# EAGLE design 411_Preliminary Design_ Group8_rev4 (EAGLE 9.6.2)
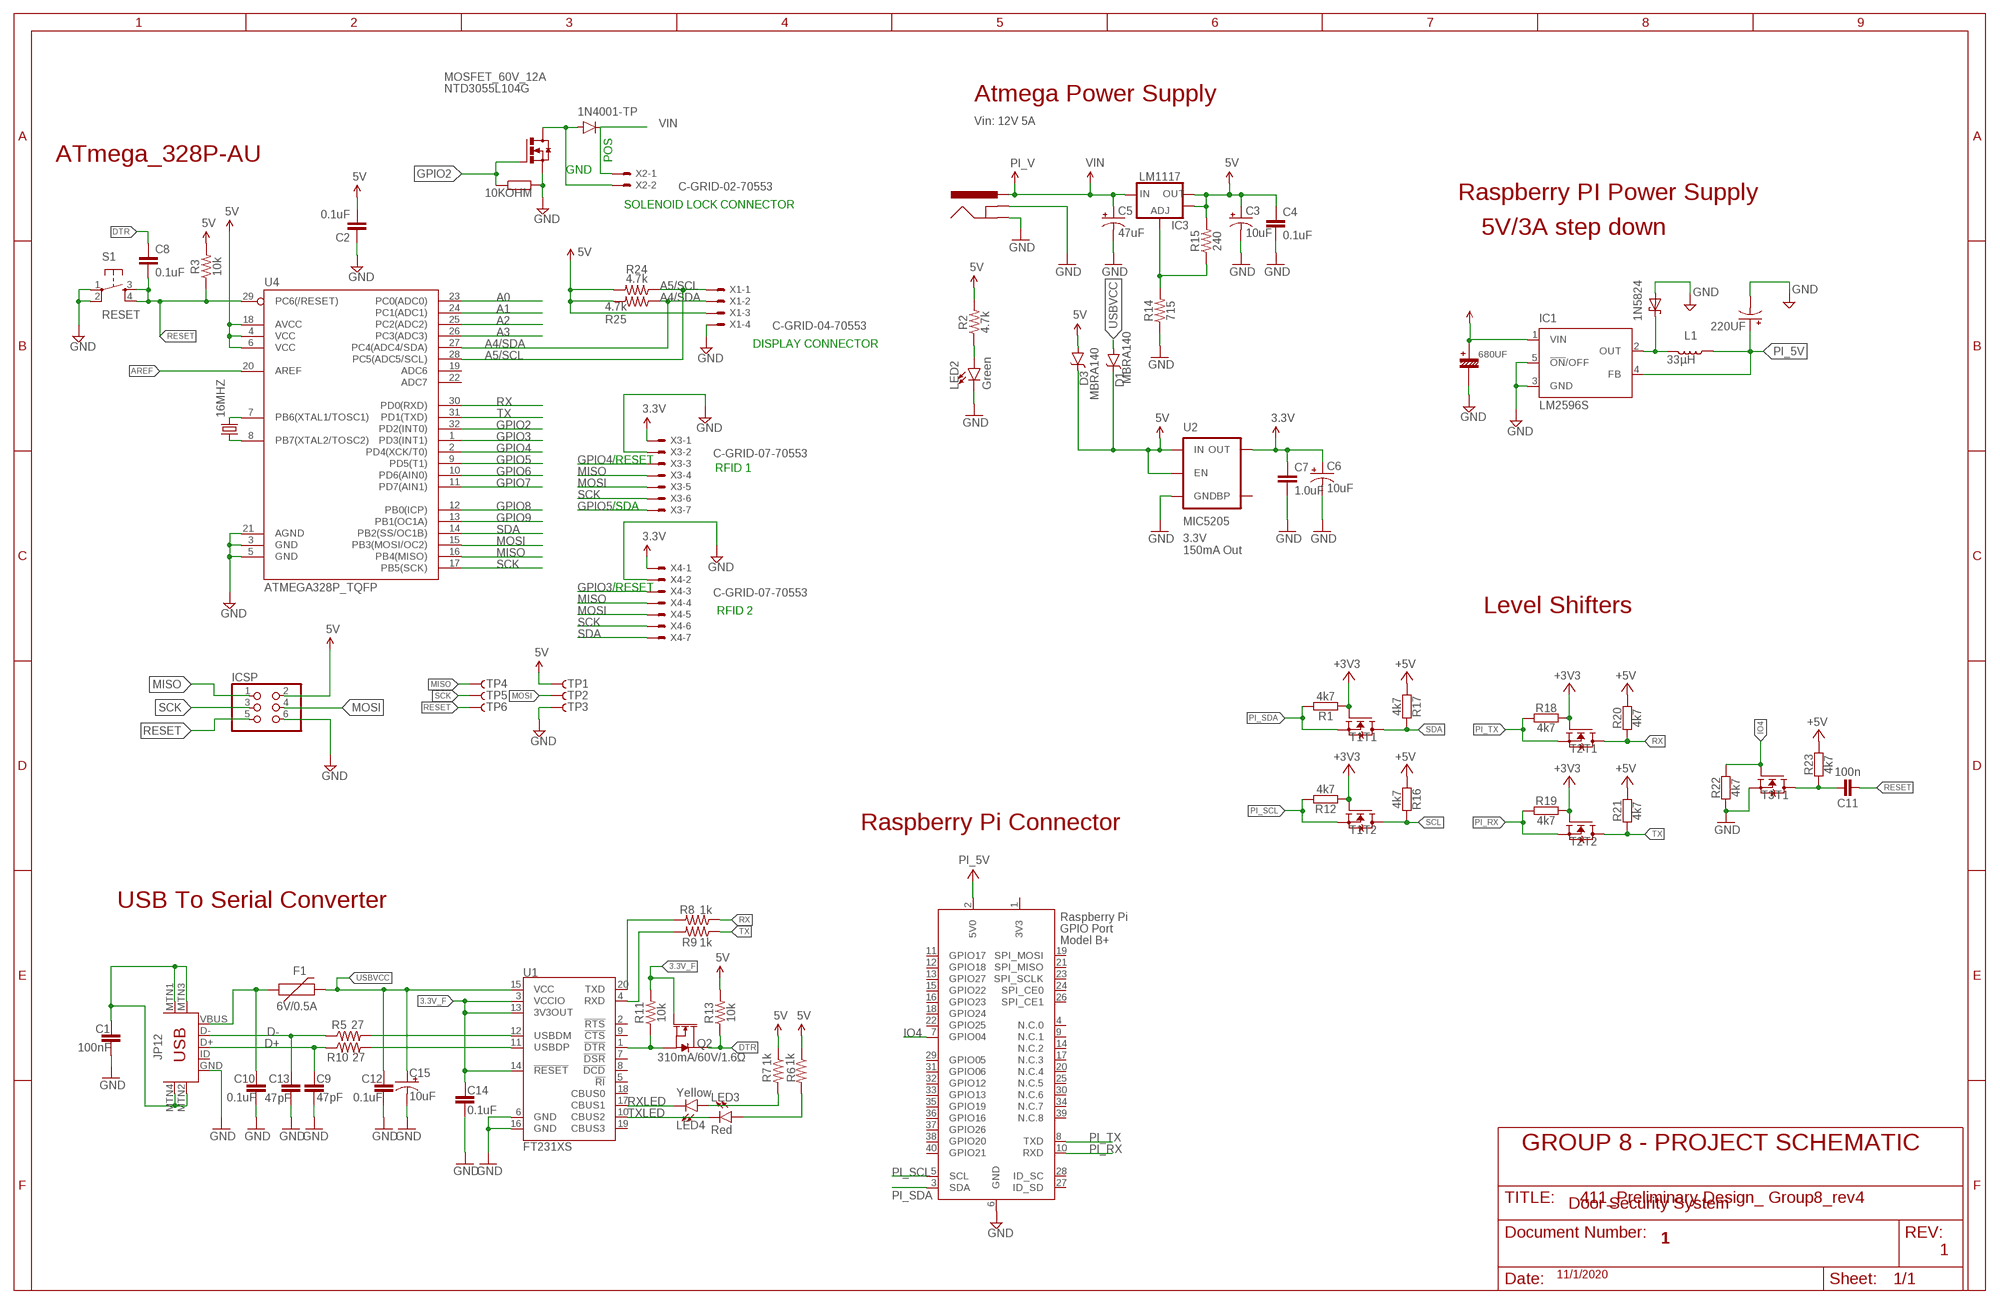
[diagram p0: schematic, sheet 1]

## Parts
1N5824  SCHOTTKY-DIODECB429-15  [CB429-15]
10KOHM  R  (no package)
16MHZ  CRYSTALHC49S  [HC49/S]
220UF  CPOL-US139CLL-2R  [139CLL-2R]
680UF  CE-16V-10-5.08  [16V-10-5.08]
C1  100nF  0.1UF-0603-25V-(+80/-20%)  [0603]
C2  0.1uF  0.1UF-0603-25V-(+80/-20%)  [0603]
C3  10uF  10UF-POLAR-EIA3216-16V-10%(TANT)  [EIA3216]
C4  0.1uF  0.1UF-0603-25V-(+80/-20%)  [0603]
C5  47uF  47UF-POLAR-PANASONIC_D-35V-20%  [PANASONIC_D]
C6  10uF  10UF-POLAR-EIA3216-16V-10%(TANT)  [EIA3216]
C7  1.0uF  1.0UF-0603-16V-10%  [0603]
C8  0.1uF  0.1UF-0603-25V-(+80/-20%)  [0603]
C9  47pF  47PF-0603-50V-5%  [0603]
C10  0.1uF  0.1UF-0603-25V-(+80/-20%)  [0603]
C11  100n  CAPACITOR-0402  [C0402]
C12  0.1uF  0.1UF-0603-25V-(+80/-20%)  [0603]
C13  47pF  47PF-0603-50V-5%  [0603]
C14  0.1uF  0.1UF-0603-25V-(+80/-20%)  [0603]
C15  10uF  10UF-POLAR-EIA3216-16V-10%(TANT)  [EIA3216]
D1  MBRA140  [SMA-DIODE]
D3  MBRA140  [SMA-DIODE]
F1  6V/0.5A  PTC-HALF_AMP  [1206]
IC1  LM2596S  [TO263-5]
IC3  LM1117  V_REG_LM1117ALT1  [SOT223-ALT1]
ICSP  PINHD-2X3  [2X03]
J3  POWER_JACKSUPER_BOMB_DIGITY  [POWER_JACK_SMD_OVERPASTE_SUPER_BOMB_DIGITY]
JP12  USB-MINIB-5PIN  [USB-MINIB]
L1  33µH  INDUCTOR-0805-3.3UH  [0805]
LED2  Green  LED1206  [LED-1206]
LED3  Red  LED1206  [LED-1206]
LED4  Yellow  LED1206  [LED-1206]
MOSFET_60V_12A  NTD3055L104G  [DPAK3]
Q2  310mA/60V/1.6Ω  MOSFET-NCH-2N7002PW  [SOT323]
R1  4k7  RESISTOR-0402  [C0402]
R2  4.7k  4.7KOHM-0603-1/10W-1%  [0603]
R3  10k  10KOHM-0603-1/10W-1%  [0603]
R5  27  27OHM-0603-1/10W-1%  [0603]
R6  1k  1KOHM-0603-1/10W-1%  [0603]
R7  1k  1KOHM-0603-1/10W-1%  [0603]
R8  1k  1KOHM-0603-1/10W-1%  [0603]
R9  1k  1KOHM-0603-1/10W-1%  [0603]
R10  27  27OHM-0603-1/10W-1%  [0603]
R11  10k  10KOHM-0603-1/10W-1%  [0603]
R12  4k7  RESISTOR-0402  [C0402]
R13  10k  10KOHM-0603-1/10W-1%  [0603]
R14  715  715OHM-0603-1/10W-1%  [0603]
R15  240  240OHM-0603-1/10W-1%  [0603]
R16  4k7  RESISTOR-0402  [C0402]
R17  4k7  RESISTOR-0402  [C0402]
R18  4k7  RESISTOR-0402  [C0402]
R19  4k7  RESISTOR-0402  [C0402]
R20  4k7  RESISTOR-0402  [C0402]
R21  4k7  RESISTOR-0402  [C0402]
R22  4k7  RESISTOR-0402  [C0402]
R23  4k7  RESISTOR-0402  [C0402]
R24  4.7k  4.7KOHM-0603-1/10W-1%  [0603]
R25  4.7k  4.7KOHM-0603-1/10W-1%  [0603]
S1  RESET  SWITCH_SPST_4_PINSQUARE  [TACTILE-SWITCH-SMD]
T1  BSS138PS  [SOT363]
T2  BSS138PS  [SOT363]
T3  BSS138PS  [SOT363]
TP1  TP-3x5  TEST-POINT3X5  [PAD.03X.05]
TP2  TP-3x5  TEST-POINT3X5  [PAD.03X.05]
TP3  TP-3x5  TEST-POINT3X5  [PAD.03X.05]
TP4  TP-3x5  TEST-POINT3X5  [PAD.03X.05]
TP5  TP-3x5  TEST-POINT3X5  [PAD.03X.05]
TP6  TP-3x5  TEST-POINT3X5  [PAD.03X.05]
U1  FT231XS  [SSOP20_L]
U2  MIC5205  MIC52053.3V  [SOT23-5]
U4  ATMEGA328P_TQFP  [TQFP32-08]
X1  C-GRID-04-70553  [70553-04]
X2  C-GRID-02-70553  [70553-02]
X3  C-GRID-07-70553  [70553-07]
X4  C-GRID-07-70553  [70553-07]
X5  RASPI_BOARD_B+_E4P  [RASPI_BOARD_B+_EDGES_4DRILL_PAD]

## Nets
3.3V: C6.+ C7.1 U2.5(OUT) X3.1 X4.1
3.3V_F: C14.1 Q2.1(G) R11.2 U1.3(VCCIO) U1.13(3V3OUT) U1.14(!RESET)
5V: 680UF.+ C2.2 C3.+ C4.1 D1.C D3.A D3.C IC1.1(VIN) IC3.2(OUT) IC3.4(OUT) ICSP.2 R2.2 R3.2 R6.1 R7.1 R13.2 R15.2 R24.2 R25.2 TP1.P$1 U2.1(IN) U2.3(EN) U4.4(VCC) U4.6(VCC) U4.18(AVCC) X1.3 ; supply symbol labelled PI_V
+3V3: R1.1 R12.1 R18.2 R19.2 T1.2(T1:G) T1.5(T2:G) T2.2(T1:G) T2.5(T2:G)
+5V: R16.1 R17.1 R20.2 R21.2 R23.2
A0: U4.23(PC0(ADC0))
A1: U4.24(PC1(ADC1))
A2: U4.25(PC2(ADC2))
A3: U4.26(PC3(ADC3))
A4/SDA: R25.1 U4.27(PC4(ADC4/SDA)) X1.2
A5/SCL: R24.1 U4.28(PC5(ADC5/SCL)) X1.1
AREF: U4.20(AREF)
D0_RX1: C11.2 R23.1 T3.6(T1:D)
D+: C9.1 JP12.D+ R10.1
D-: C13.1 JP12.D- R5.1
DTR: C8.1 Q2.3(D) R13.1
FTDI_DTR: Q2.2(S) R11.1 U1.1(!DTR)
GND: 1N5824.A 10KOHM.2 220UF.- 680UF.- C1.2 C2.1 C3.- C4.2 C5.- C6.- C7.2 C9.2 C10.2 C12.2 C13.2 C14.2 C15.- IC1.3(GND) IC1.5(!ON!/OFF) ICSP.6 J3.GND(GNDBREAK) J3.P$4(GND) JP12.GND LED2.C MOSFET_60V_12A.2(S) R14.1 R22.1 S1.1 S1.2 T3.1(T1:S) TP3.P$1 U1.6(GND) U1.16(GND) U2.2(GND) U4.3(GND) U4.5(GND) U4.21(AGND) X1.4 X3.2 X4.2 X5.6(GND)
GPIO2: 10KOHM.1 MOSFET_60V_12A.1(G) U4.32(PD2(INT0))
GPIO3: U4.1(PD3(INT1)) X4.3
GPIO4: U4.2(PD4(XCK/T0)) X3.3
GPIO5: U4.9(PD5(T1)) X3.7
GPIO6: U4.10(PD6(AIN0))
GPIO7: U4.11(PD7(AIN1))
GPIO8: U4.12(PB0(ICP))
GPIO9: U4.13(PB1(OC1A))
IO4: R22.2 T3.2(T1:G) X5.7(GPIO04)
MISO: ICSP.1 TP4.P$1 U4.16(PB4(MISO)) X3.4 X4.4
MOSI: ICSP.4 TP2.P$1 U4.15(PB3(MOSI/OC2)) X3.5 X4.5
N$1: 1N5824.C IC1.2(OUT) L1.2
N$2: LED2.A R2.1
N$3: 16MHZ.2 U4.7(PB6(XTAL1/TOSC1))
N$4: 16MHZ.1 U4.8(PB7(XTAL2/TOSC2))
N$5: MOSFET_60V_12A.3(D) X2.2
N$6: R5.2 U1.12(USBDM)
N$7: R10.2 U1.11(USBDP)
N$8: LED3.A R6.2
N$10: LED4.A R7.2
N$15: IC3.1(ADJ) R14.2 R15.1
N$17: C1.1 JP12.MTN1(MTN2) JP12.MTN2(MTN3) JP12.MTN3(MTN1) JP12.MTN4
PI_5V: 220UF.+ IC1.4(FB) L1.1 X5.2(5V0) ; supply symbol labelled +5V
PI_RX: R19.1 T2.4(T2:S) X5.10(RXD)
PI_SCL: R12.2 T1.4(T2:S) X5.5(SCL)
PI_SDA: R1.2 T1.1(T1:S) X5.3(SDA)
PI_TX: R18.1 T2.1(T1:S) X5.8(TXD)
RESET: C8.2 C11.1 ICSP.5 R3.1 S1.3 S1.4 TP6.P$1 U4.29(PC6(/RESET))
RX: R8.1 R20.1 T2.6(T1:D) U4.30(PD0(RXD))
RXD: R9.2 U1.4(RXD)
RXLED: LED4.C U1.17(CBUS1)
SCK: ICSP.3 TP5.P$1 U4.17(PB5(SCK)) X3.6 X4.6
SCL: R16.2 T1.3(T2:D)
SDA: R17.2 T1.6(T1:D) U4.14(PB2(SS/OC1B)) X4.7
TX: R9.1 R21.1 T2.3(T2:D) U4.31(PD1(TXD))
TXD: R8.2 U1.20(TXD)
TXLED: LED3.C U1.10(CBUS2)
USBVCC: C12.1 C15.+ D1.A F1.2 U1.15(VCC)
VIN: C5.+ IC3.3(IN) J3.VIN0(PWR) X2.1 ; supply symbol labelled PI_V
VUSB: C10.1 F1.1 JP12.VBUS
Unconnected: JP12.ID T3.3(T2:D) T3.4(T2:S) T3.5(T2:G) U1.2(!RTS) U1.5(!RI) U1.7(!DSR) U1.8(!DCD) U1.9(!CTS) U1.18(CBUS0) U1.19(CBUS3) U2.4(BP) U4.19(ADC6) U4.22(ADC7) X5.4(N.C.0) X5.9(N.C.1) X5.11(GPIO17) X5.12(GPIO18) X5.13(GPIO27) X5.14(N.C.2) X5.15(GPIO22) X5.16(GPIO23) X5.17(N.C.3) X5.18(GPIO24) X5.19(SPI_MOSI) X5.20(N.C.4) X5.21(SPI_MISO) X5.22(GPIO25) X5.23(SPI_SCLK) X5.24(SPI_CE0) X5.25(N.C.5) X5.26(SPI_CE1) X5.27(ID_SD) X5.28(ID_SC) X5.29(GPIO05) X5.30(N.C.6) X5.31(GPIO06) X5.32(GPIO12) X5.33(GPIO13) X5.34(N.C.7) X5.35(GPIO19) X5.36(GPIO16) X5.37(GPIO26) X5.38(GPIO20) X5.39(N.C.8) X5.40(GPIO21)

## Notes on the sheet
- Atmega Power Supply
- 1N4001-TP
- Vin: 12V 5A
- ATmega_328P-AU | POS
- GND
- Raspberry PI Power Supply
- SOLENOID LOCK CONNECTOR
- 5V/3A step down
- DISPLAY CONNECTOR
- /RESET | RFID 1
- /SDA
- 3.3V
  150mA Out
- /RESET
- RFID 2 | Level Shifters
- SDA
- Level Shifter
- Raspberry Pi Connector
- USB To Serial Converter
- GROUP 8 - PROJECT SCHEMATIC
- Door Security System
- 1
- 1
- 11/1/2020

## Power pins joined to a net without a drawn wire
3V3: X5.1(3V3)

## Library data of the parts
1N5824 = adafruit:SCHOTTKY-DIODE: Schottky Diode
10KOHM = ngspice-simulation:R: RESISTOR
16MHZ = crystal:CRYSTAL: CRYSTAL; OC_FARNELL: 1667008; OC_NEWARK: unknown
220UF = adafruit:CPOL-US: POLARIZED CAPACITOR, American symbol
680UF = c-j:CE-: ELECTROLYTIC CAPACITOR Japanese symbol
C1 = SparkFun-Capacitors:0.1UF: 0.1µF ceramic capacitors A capacitor is a passive two-terminal electrical component used to store electrical energy temporarily in an electric field.; PROD_ID: CAP-00810; VALUE: 0.1uF
C2 C4 C8 C10 C12 C14 = SparkFun-Capacitors:0.1UF: 0.1µF ceramic capacitors A capacitor is a passive two-terminal electrical component used to store electrical energy temporarily in an electric field.; PROD_ID: CAP-00810
C3 C6 C15 = SparkFun-Capacitors:10UF-POLAR: 10.0µF polarized capacitors A capacitor is a passive two-terminal electrical component used to store electrical energy temporarily in an electric field.; PROD_ID: CAP-00811
C5 = SparkFun-Capacitors:47UF-POLAR: 47µF polarized capacitors A capacitor is a passive two-terminal electrical component used to store electrical energy temporarily in an electric field.; PROD_ID: CAP-08478
C7 = SparkFun-Capacitors:1.0UF: 1µF ceramic capacitors A capacitor is a passive two-terminal electrical component used to store electrical energy temporarily in an electric field.; PROD_ID: CAP-00868
C9 C13 = SparkFun-Capacitors:47PF: 47pF ceramic capacitors A capacitor is a passive two-terminal electrical component used to store electrical energy temporarily in an electric field.; PROD_ID: CAP-08913
C11 = we-rcl:CAPACITOR: Capacitors ...4.7uF @ 6.3V -> 0402 ...10uF @ 16V -> 0603 ...22uF @ 25V -> 0805
D1 D3 = SparkFun-DiscreteSemi:MBRA140: 40V, 1A Schottky rectifier SMA/DO-214AC package DIO-08053; PROD_ID: DIO-08053
F1 = SparkFun-Fuses:PTC: Resettable Fuse PTC Resettable Fuse. Really a resistor with a postive temperature coefficient who's resistance increases dramatically with an increase in temperature. When heated by the power passing through the resistance rises causing the current to be limited, protecting the circuit. When a PTC cools back down it resumes conducting letting the circuit turn back on.; PROD_ID: RES-08585
IC1 = national-semiconductor:LM2596: SIMPLE SWITCHER® Power Converter 150 kHz 3A Step-Down Voltage Regulator Source: http://www.national.com/ds/LM/LM2596.pdf; MF: NATIONAL SEMICONDUCTOR; MPN: LM2596S-ADJ/NOPB; OC_FARNELL: 9494367; OC_NEWARK: 41K3842
IC3 = Testing:V_REG_LM1117: Voltage Regulator LM1117 Standard adjustable voltage regulator but in SMD form. Spark Fun Electronics SKU : COM-00595; PROD_ID: VREG-08170
ICSP = pinhead:PINHD-2X3: PIN HEADER
J3 = Testing:POWER_JACK: Power Jack This is the standard 5.5mm barrel jack for power. The PTH is the most common, proven, reliable, footprint. All others are experimental. The Slot footprint only works if the mill layer is transmitted to the PCB fab house so be warned. Spark Fun Electronics SKU : PRT-00119. Mating wall wart : TOL-00298 (and others); PROD_ID: CONN-08106
JP12 = SparkFun-Connectors:USB-MINIB: Mini-USB "B" connector with 5th pin broken out. Created new symbol breaking out 5th "ID" pin in mini/micro USB connector spec. See: http://en.wikipedia.org/wiki/Mini_usb#Cables. Uses same footprint as 4-pin symbol. Also added pins to connect to mounting / shield pads if required (probably not generally needed as signals aren't shielded once they leave the connector).; PROD_ID: CONN-08193
L1 = SparkFun-Coils:INDUCTOR: Inductors Resist changes in electrical current. Basically a coil of wire. SparkFun Products: SparkFun Load Cell Amplifier - HX711 <https://www.sparkfun.com/products/13879> IOIO-OTG - V2.2 <https://www.sparkfun.com/products/13613>; PROD_ID: NDUC-13076; VALUE: 3.3µH/±20%/450mA
LED2 = SparkFun-LED:LED: LED (Generic) Standard schematic elements and footprints for 5mm, 3mm, 1206, and 0603 sized LEDs. Generic LEDs with no color specified.; PROD_ID: DIO-09910
LED3 = SparkFun-LED:LED: LED (Generic) Standard schematic elements and footprints for 5mm, 3mm, 1206, and 0603 sized LEDs. Generic LEDs with no color specified.; PROD_ID: DIO-09912
LED4 = SparkFun-LED:LED: LED (Generic) Standard schematic elements and footprints for 5mm, 3mm, 1206, and 0603 sized LEDs. Generic LEDs with no color specified.; PROD_ID: DIO-09909
MOSFET_60V_12A = Transistor:NTD3055L104G: 12 A, 60 V, Logic Level N−Channel DPAK/IPAK Manufacturer's datasheet <https://www.onsemi.com/pub/Collateral/NTD3055L104-D.PDF>; CREATED_BY: PCBLayout.com; MANUFACTURER: ON SEMICONDUCTORS; MPN: NTD3055L104G; PACKAGE: DPAK-4
Q2 = SparkFun-DiscreteSemi:MOSFET-NCH: N-channel MOSFETs Voltage controlled devices that allow control of high current outputs. SparkFun Products: SparkFun OpenScale <https://www.sparkfun.com/products/13261> SparkFun Digital Sandbox <https://www.sparkfun.com/products/12651> SparkFun Monster Moto Shield <https://www.sparkfun.com/products/10182> SparkFun MOSFET Power Controller <https://www.sparkfun.com/products/11214>; PROD_ID: TRANS-11151
R1 R12 R16-R23 = we-rcl:RESISTOR: Resistors all kinds in 0603 and 0402
R2 R24 R25 = SparkFun-Resistors:4.7KOHM: 4.7kΩ resistor A resistor is a passive two-terminal electrical component that implements electrical resistance as a circuit element. Resistors act to reduce current flow, and, at the same time, act to lower voltage levels within circuits. - Wikipedia; PROD_ID: RES-07857
R3 R11 R13 = SparkFun-Resistors:10KOHM: 10kΩ resistor A resistor is a passive two-terminal electrical component that implements electrical resistance as a circuit element. Resistors act to reduce current flow, and, at the same time, act to lower voltage levels within circuits. - Wikipedia; PROD_ID: RES-00824
R5 R10 = SparkFun-Resistors:27OHM: 27Ω resistor A resistor is a passive two-terminal electrical component that implements electrical resistance as a circuit element. Resistors act to reduce current flow, and, at the same time, act to lower voltage levels within circuits. - Wikipedia; PROD_ID: RES-09334
R6-R9 = SparkFun-Resistors:1KOHM: 1kΩ resistor A resistor is a passive two-terminal electrical component that implements electrical resistance as a circuit element. Resistors act to reduce current flow, and, at the same time, act to lower voltage levels within circuits. - Wikipedia; PROD_ID: RES-07856
R14 = SparkFun-Resistors:715OHM: 715Ω resistor A resistor is a passive two-terminal electrical component that implements electrical resistance as a circuit element. Resistors act to reduce current flow, and, at the same time, act to lower voltage levels within circuits. - Wikipedia; PROD_ID: RES-07850
R15 = SparkFun-Resistors:240OHM: 240Ω resistor A resistor is a passive two-terminal electrical component that implements electrical resistance as a circuit element. Resistors act to reduce current flow, and, at the same time, act to lower voltage levels within circuits. - Wikipedia; PROD_ID: RES-07849
S1 = SparkFun-Electromechanical:SWITCH_SPST_4_PIN; PROD_ID: SWCH-08247
T1-T3 = we-transistor:BSS138PS: BSS138 Dual N-Channel MOSFET (UGS +/-20V, RDS 1Ohm, ID 320mA)
TP1-TP4 TP6 = SparkFun-Connectors:TEST-POINT: SparkFun Test Points Bare copper test points for troubleshooting or In-Circuit-Testing. These are used by our Production team for verifying production board runs using pogo-pins on test beds. SparkFun Products: SparkFun LSM9DS1 Breakout <https://www.sparkfun.com/products/13284> SparkFun PSOC <https://www.sparkfun.com/products/13714> SparkFun Load Cell Amplifier <https://www.sparkfun.com/products/13879>
TP5 = SparkFun-Passives:TEST-POINT: Bare copper test points for troubleshooting or ICT
U1 = SparkFun-IC-Comms:FT231X: FTDI FT231X Full Speed USB to Full-handshake UART This USB2.0 Full Speed IC offers a compact bridge to full handshake UART interfaces. The device is a UART, capable of operating up to 3MBaud, with low power consumption (8mA). The FT231X includes the complete FT-X series feature set and enables USB to be added into a system design quickly and easily over a UART interface. Datasheet <http://cdn.sparkfun.com/datasheets/Components/General%20IC/DS_FT231X.pdf> SparkFun Products SparkFun RedBoard - Programmed with Arduino <https://www.sparkfun.com/products/12757> (DEV-12757) SparkFun XBee Explorer USB <https://www.sparkfun.com/products/11812> (WRL-11812) SparkFun XBee Explorer Dongle <https://www.sparkfun.com/products/11697> (WRL-11697) SparkFun Blynk Board - ESP8266 <https://www.sparkfun.com/products/13794> (WRL-13794) SparkFun ESP8266 Thing - Dev Board <https://www.sparkfun.com/products/13711> (WRL-13711) SparkFun Block for Intel® Edison - Base <https://www.sparkfun.com/products/13045> (DEV-13045) SparkFun RedStick <https://www.sparkfun.com/products/13741> (DEV-13741) SparkFun Beefy 3 - FTDI Basic Breakout <https://www.sparkfun.com/products/13746> (DEV-13746) SparkFun FT231X Breakout <https://www.sparkfun.com/products/11736> (BOB-11736); PROD_ID: IC-11524
U2 = SparkFun-PowerIC:MIC5205: MIC5205 150mA vreg 3.3V - VREG-00822 5V - VREG-00823; PROD_ID: VREG-00822
U4 = SparkFun-IC-Microcontroller:ATMEGA328P_TQFP: Popular 328P in QFP Storefront component: ATmega328 - TQFP <https://www.sparkfun.com/products/13448> (COM-13448) Datasheet <http://www.sparkfun.com/datasheets/Components/SMD/ATMega328.pdf> SparkFun Products SparkFun RedBoard - Programmed with Arduino <https://www.sparkfun.com/products/12757> (DEV-12757) Arduino Pro Mini 328 - 5V/16MHz <https://www.sparkfun.com/products/11113> (DEV-11113) Arduino Pro Mini 328 - 3.3V/8MHz <https://www.sparkfun.com/products/11114> (DEV-11114) SparkFun OpenLog <https://www.sparkfun.com/products/13712> (DEV-13712) SparkFun MicroView - OLED Arduino Module <https://www.sparkfun.com/products/12923> (DEV-12923) SparkFun Digital Sandbox <https://www.sparkfun.com/products/12651> (DEV-12651) SparkFun PicoBoard <https://www.sparkfun.com/products/11888> (WIG-11888) Arduino Fio <https://www.sparkfun.com/products/10116> (DEV-10116) LilyPad Arduino 328 Main Board <https://www.sparkfun.com/products/13342> (DEV-13342) SparkFun RedStick <https://www.sparkfun.com/products/13741> (DEV-13741) LilyPad MP3 <https://www.sparkfun.com/products/11013> (DEV-11013) LilyPad Arduino SimpleSnap <https://www.sparkfun.com/products/10941> (DEV-10941) SparkFun Stepoko <https://www.sparkfun.com/products/13899> (ROB-13899) SparkFun Geiger Counter <https://www.sparkfun.com/products/11345> (SEN-11345) SparkFun EL Sequencer <https://www.sparkfun.com/products/12781> (COM-12781) Arduino Pro 328 - 5V/16MHz <https://www.sparkfun.com/products/10915> (DEV-10915) CryptoCape <https://www.sparkfun.com/products/12773> (DEV-12773) SparkFun IR Thermometer Evaluation Board - MLX90614 <https://www.sparkfun.com/products/10740> (SEN-10740) SparkFun RedBot Mainboard <https://www.sparkfun.com/products/12097> (ROB-12097) Arduino Pro 328 - 3.3V/8MHz <https://www.sparkfun.com/products/10914> (DEV-10914) SparkFun Block for Intel® Edison - Arduino <https://www.sparkfun.com/products/13036> (DEV-13036) SparkFun Simon Says - Surface Mount Soldering Kit <https://www.sparkfun.com/products/10935> (KIT-10935) SparkFun 7-Segment Serial Display - Red <https://www.sparkfun.com/products/11441> (COM-11441) SparkFun 7-Segment Serial Display - White <https://www.sparkfun.com/products/11629> (COM-11629) SparkFun 7-Segment Serial Display - Yellow <https://www.sparkfun.com/products/11443> (COM-11443) SparkFun 7-Segment Serial Display - Kelly Green <https://www.sparkfun.com/products/11440> (COM-11440) SparkFun 7-Segment Serial Display - Blue <https://www.sparkfun.com/products/11442> (COM-11442) SparkFun OpenSegment Serial Display - 20mm (Blue) <https://www.sparkfun.com/products/11647> (COM-11647) SparkFun OpenSegment Serial Display - 20mm (Green) <https://www.sparkfun.com/products/11646> (COM-11646) SparkFun OpenSegment Serial Display - 20mm (White) <https://www.sparkfun.com/products/11648> (COM-11648) SparkFun OpenSegment Serial Display - 20mm (Red) <https://www.sparkfun.com/products/11644> (COM-11644) SparkFun OpenSegment Serial Display - 20mm (Yellow) <https://www.sparkfun.com/products/11645> (COM-11645) SparkFun OpenSegment Shield <https://www.sparkfun.com/products/13190> (DEV-13190); PROD_ID: IC-09069
X1 = con-molex:C-GRID-04: CONNECTOR wire to board 2.54 mm (0.100") pitch header; MF: MOLEX; OC_FARNELL: unknown; OC_NEWARK: unknown
X2 = con-molex:C-GRID-02: CONNECTOR wire to board 2.54 mm (0.100") pitch header; MF: MOLEX; OC_FARNELL: unknown; OC_NEWARK: unknown
X3 X4 = con-molex:C-GRID-07: CONNECTOR wire to board 2.54 mm (0.100") pitch header; MF: MOLEX; OC_FARNELL: unknown; OC_NEWARK: unknown
X5 = raspberrypi_bastelstube_v13:RASPI_BOARD_B+: Raspberry Pi GPIO connector with markings for the outer dimensions of the Raspberry Pi board model B+ with different sets of drill holes or mounting pads

## Board
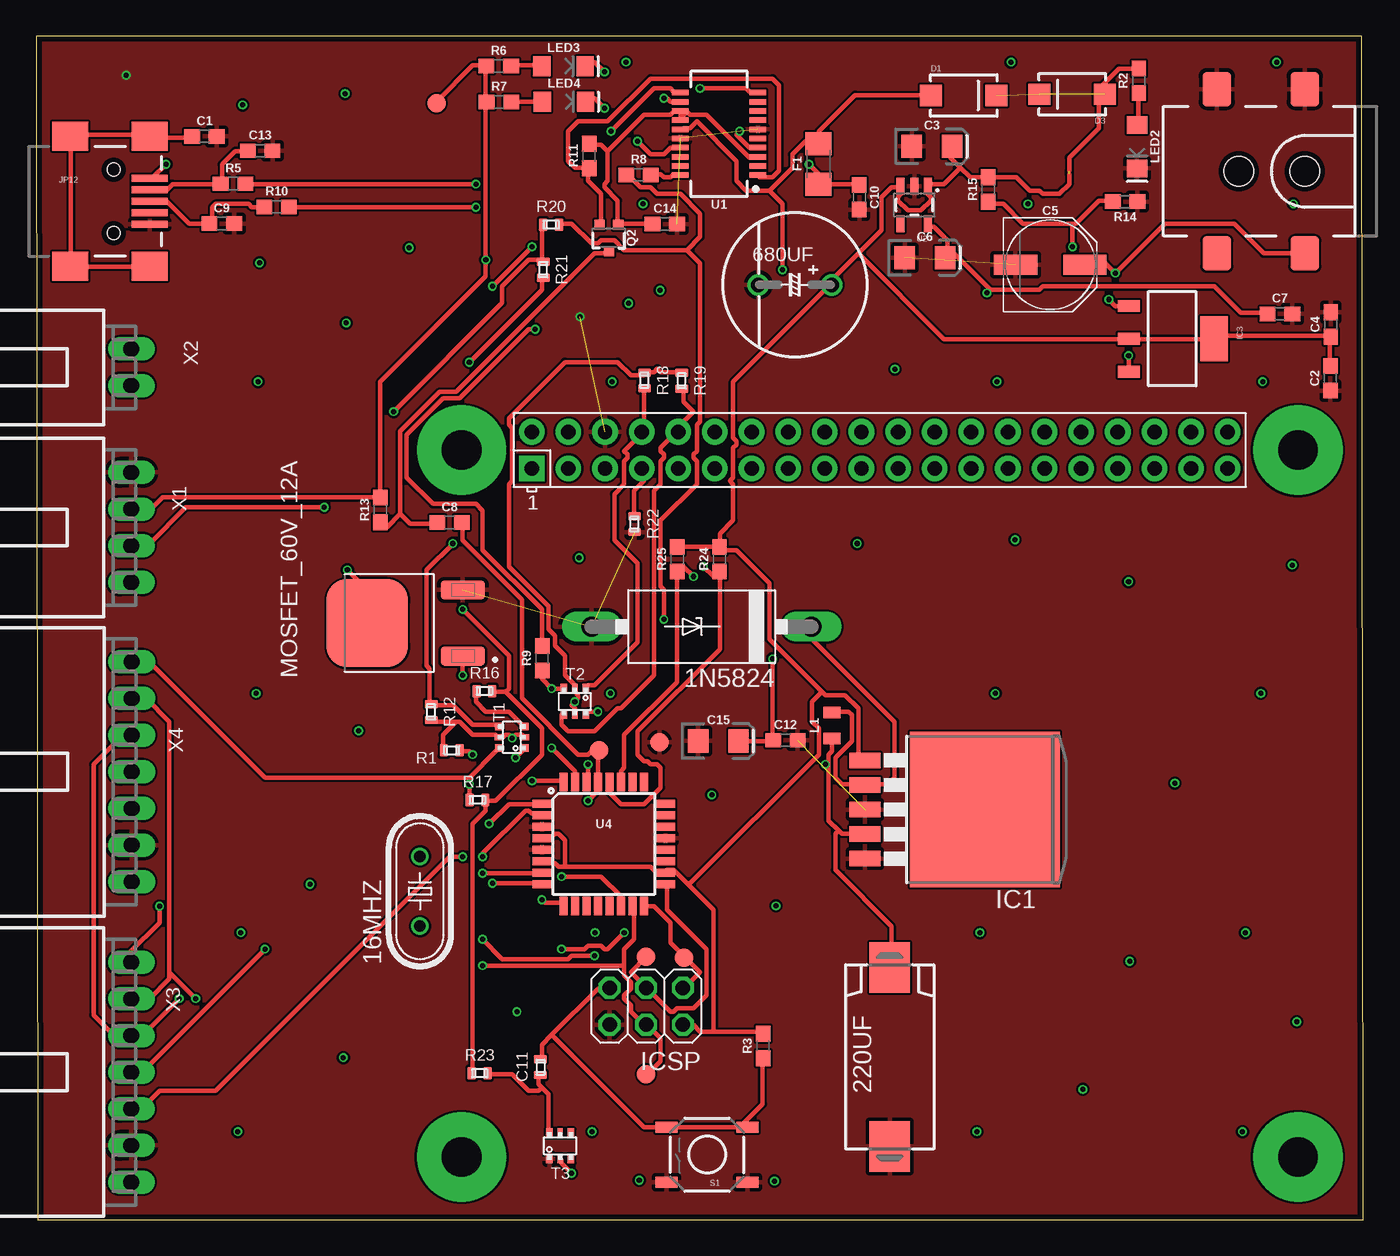
[diagram p1: board, top side]
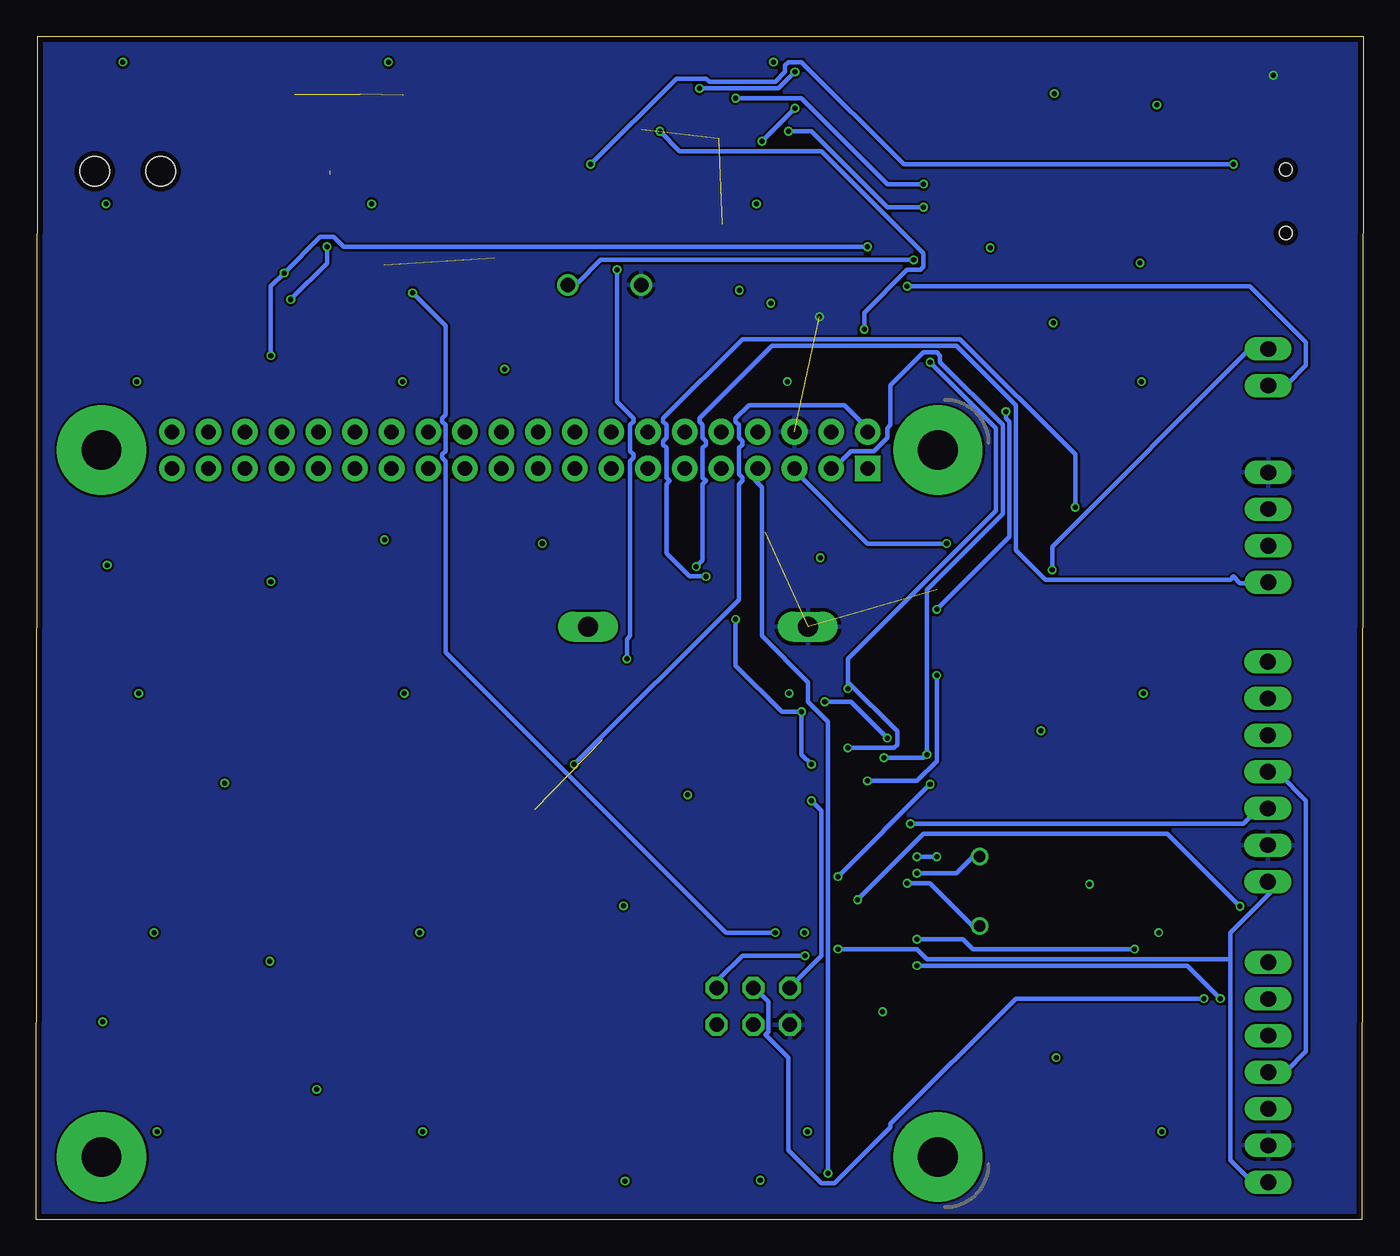
[diagram p2: board, bottom side, seen from below]

Size 92.06 x 82.04 mm. Coordinates in mm from the lower left corner, seen from the top.
Outline: 0.1,0 92.05,0 91.95,82.04 0,82.04 0.1,0
Copper layers (1*16): Top 0.035559375mm / dielectric 1.6mm / Bottom 0.035559375mm
Design rules "oshpark-2layer": minimum track width 6mil, minimum drill 10mil, track to track 6mil, track to pad 6mil, pad to pad 6mil, via to via 6mil, smd to smd 6mil, copper to edge 15mil, drill to drill 6mil, minimum pad ring 5mil, minimum via ring 5mil, stop-mask expansion 2.5mil, vias tented up to drill 0mil, thermal gap 10mil

### Footprints (pad centres in the part's own frame; a part is rotated, then mirrored left to right if it is on the bottom)
CB429-15 = drill 1.397 long: A 7.62,0; C -7.62,0
HC49/S = drill 0.813: 1 -2.413,0; 2 2.413,0
139CLL-2R = smd 3.5 x 2.8: + 6.2,0; - -6.2,0
16V-10-5.08 = drill 1: + -2.54,0; - 2.54,0
0603 = smd 1.1 x 1: 1 -0.85,0; 2 0.85,0
EIA3216 = smd 1.4 x 1.6: + 1.4,0; - -1.4,0
PANASONIC_D = smd 3 x 1.4: + 2.4,0; - -2.4,0
C0402 = smd 0.9 x 0.6: 1 0,0.55; 2 0,-0.55
SMA-DIODE = smd 1.524 x 1.47: A -2.277,0; C 2.277,0
1206 = smd 1.6 x 1.8: 1 -1.4,0; 2 1.4,0
TO263-5 = smd 1.067 x 2.159: 1 -3.404,-5.791; 2 -1.702,-5.791; 3 0,-5.791; 4 1.702,-5.791; 5 3.404,-5.791 | smd 10.8 x 10.41: 6 0,2.54
SOT223-ALT1 = smd 0.813 x 1.524: 1 -2.271,-3.02; 2 0,-3.02; 3 2.288,-3.02 | smd 3.124 x 1.905: 4 0,2.921
2X03 = drill 1.016 octagon: 1 -2.54,-1.27; 2 -2.54,1.27; 3 0,-1.27; 4 0,1.27; 5 2.54,-1.27; 6 2.54,1.27
POWER_JACK_SMD_OVERPASTE_SUPER_BOMB_DIGITY = smd 2 x 2.4: GND 0,-5.7; P$4 6.1,-5.7; VIN0 0,5.7; VIN1 6.1,5.7 | hole 2.032: 0,0; 4.572,0
USB-MINIB = smd 2.5 x 0.5: D+ 2.5,0; D- 2.5,0.8; GND 2.5,-1.6; ID 2.5,-0.8; VBUS 2.5,1.6 | smd 2.5 x 2: MTN1 -3,4.5; MTN2 2.5,4.5; MTN3 -3,-4.5; MTN4 2.5,-4.5 | hole 0.9: 0,2.2; 0,-2.2
0805 = smd 0.8 x 1.2: 1 -0.9,0; 2 0.9,0
LED-1206 = smd 1.2 x 1.4: A -1.5,0; C 1.5,0
DPAK3 = smd 1.31 x 3.08: 1 -2.29,-4.12; 2 2.29,-4.12 | smd 6.09 x 5.63: 3 0,2.51
SOT323 = smd 0.7 x 0.7: 1 -0.65,-0.925; 2 0.65,-0.925; 3 0,0.925
TACTILE-SWITCH-SMD = smd 1.524 x 0.762: 1 -2.794,1.905; 2 2.794,1.905; 3 -2.794,-1.905; 4 2.794,-1.905
SOT363 = smd 0.6 x 0.5: 1 -0.9,0.75; 3 -0.9,-0.75; 4 0.9,-0.75; 6 0.9,0.75 | smd 0.6 x 0.4: 2 -0.9,0; 5 0.9,0
PAD.03X.05 = smd 1.27 x 1.27: P$1 0,0
SSOP20_L = smd 0.381 x 1.143: 1 -2.857,-2.68; 2 -2.223,-2.68; 3 -1.587,-2.68; 4 -0.953,-2.68; 5 -0.318,-2.68; 6 0.318,-2.68; 7 0.953,-2.68; 8 1.587,-2.68; 9 2.223,-2.68; 10 2.857,-2.68; 11 2.857,2.68; 12 2.223,2.68; 13 1.587,2.68; 14 0.953,2.68; 15 0.318,2.68; 16 -0.318,2.68; 17 -0.953,2.68; 18 -1.587,2.68; 19 -2.223,2.68; 20 -2.857,2.68
SOT23-5 = smd 0.55 x 1.2: 1 -0.95,-1.3; 2 0,-1.3; 3 0.95,-1.3; 4 0.95,1.3; 5 -0.95,1.3
TQFP32-08 = smd 1.27 x 0.559: 1 -4.293,2.8; 2 -4.293,2; 3 -4.293,1.2; 4 -4.293,0.4; 5 -4.293,-0.4; 6 -4.293,-1.2; 7 -4.293,-2; 8 -4.293,-2.8; 17 4.293,-2.8; 18 4.293,-2; 19 4.293,-1.2; 20 4.293,-0.4; 21 4.293,0.4; 22 4.293,1.2; 23 4.293,2; 24 4.293,2.8 | smd 0.559 x 1.27: 9 -2.8,-4.293; 10 -2,-4.293; 11 -1.2,-4.293; 12 -0.4,-4.293; 13 0.4,-4.293; 14 1.2,-4.293; 15 2,-4.293; 16 2.8,-4.293; 25 2.8,4.293; 26 2,4.293; 27 1.2,4.293; 28 0.4,4.293; 29 -0.4,4.293; 30 -1.2,4.293; 31 -2,4.293; 32 -2.8,4.293
70553-04 = drill 1.092 long: 1 -3.81,-7.62; 2 -1.27,-7.62; 3 1.27,-7.62; 4 3.81,-7.62
70553-02 = drill 1.092 long: 1 -1.27,-7.62; 2 1.27,-7.62
70553-07 = drill 1.092 long: 1 -7.62,-7.62; 2 -5.08,-7.62; 3 -2.54,-7.62; 4 0,-7.62; 5 2.54,-7.62; 6 5.08,-7.62; 7 7.62,-7.62
RASPI_BOARD_B+_EDGES_4DRILL_PAD = drill 1 pad 1.778 square: 1 8.37,51.23 | drill 1 pad 1.778: 2 8.37,53.77; 3 10.91,51.23; 4 10.91,53.77; 5 13.45,51.23; 6 13.45,53.77; 7 15.99,51.23; 8 15.99,53.77; 9 18.53,51.23; 10 18.53,53.77; 11 21.07,51.23; 12 21.07,53.77; 13 23.61,51.23; 14 23.61,53.77; 15 26.15,51.23; 16 26.15,53.77; 17 28.69,51.23; 18 28.69,53.77; 19 31.23,51.23; 20 31.23,53.77; 21 33.77,51.23; 22 33.77,53.77; 23 36.31,51.23; 24 36.31,53.77; 25 38.85,51.23; 26 38.85,53.77; 27 41.39,51.23; 28 41.39,53.77; 29 43.93,51.23; 30 43.93,53.77; 31 46.47,51.23; 32 46.47,53.77; 33 49.01,51.23; 34 49.01,53.77; 35 51.55,51.23; 36 51.55,53.77; 37 54.09,51.23; 38 54.09,53.77; 39 56.63,51.23; 40 56.63,53.77 | drill 2.75 pad 6.2: 41 3.5,3.5; 42 61.5,3.5; 43 61.5,52.5; 44 3.5,52.5

### Placement (x,y rotation side)
1N5824  46.15,41.1 180 top
16MHZ  26.62,22.76 90 top
220UF  59.21,11.28 90 top
680UF  52.63,64.8 180 top
C1  11.68,75.08 0 top
C2  89.76,58.32 90 top
C3  62.13,74.4 0 top
C4  89.79,62.05 90 top
C5  70.33,66.19 0 top
C6  61.65,66.67 0 top
C7  86.26,62.79 0 top
C8  28.68,48.31 0 top
C9  12.88,69.04 0 top
C10  57.1,70.87 270 top
C11  34.98,10.57 0 top
C12  51.97,33.22 0 top
C13  15.54,74.09 0 top
C14  43.61,69.01 0 top
C15  47.32,33.17 0 top
D1  64.34,77.93 0 top
D3  71.86,78 180 top
F1  54.25,73.18 90 top
IC1  63.27,28.42 270 top
IC3  78.79,61.06 270 top
ICSP  42.32,14.78 180 top
J3  87.99,72.67 180 top
JP12  5.38,70.59 0 top
L1  55.19,34.24 90 top
LED2  76.35,74.37 270 top
LED3  36.58,79.96 0 top
LED4  36.6,77.5 0 top
MOSFET_60V_12A  25.48,41.35 90 top
Q2  39.73,68.05 180 top
R1  28.83,32.54 90 top
R2  76.48,78.94 90 top
R3  50.42,12.04 90 top
R5  13.67,71.81 0 top
R6  32.08,79.96 0 top
R7  32.11,77.47 0 top
R8  41.78,72.42 0 top
R9  35.1,38.91 90 top
R10  16.69,70.21 0 top
R11  38.35,73.74 90 top
R12  27.41,35.18 180 top
R13  23.88,49.2 90 top
R14  75.51,70.56 180 top
R15  66.04,71.4 90 top
R16  31.09,36.63 270 top
R17  30.61,29.08 270 top
R18  42.19,58.17 180 top
R19  44.78,58.14 180 top
R20  35.71,68.96 270 top
R21  35.18,65.84 180 top
R22  41.5,48.21 180 top
R23  30.76,10.13 270 top
R24  47.4,45.77 90 top
R25  44.48,45.77 90 top
S1  46.53,4.5 180 top
T1  32.99,33.43 180 top
T2  37.36,35.92 270 top
T3  36.35,5.11 90 top
TP1  27.76,77.39 0 top
TP2  42.29,10.06 0 top
TP3  43.23,33.07 0 top
TP4  44.93,18.16 0 top
TP5  42.32,18.21 0 top
TP6  39.04,32.54 0 top
U1  47.37,75.26 90 top
U2  60.91,70.33 180 top
U4  39.37,26.04 0 top
X1  -1.02,47.98 90 top
X2  -1.02,59.08 90 top
X3  -1.02,10.21 90 top
X4  -0.99,31.04 90 top
X5  26.01,0.84 0 top

### Tracks (layer width: path | path; a pad name or v marks a point on that pad's centre or on a via)
3.3V  (via drill 0.35)
  Top 0.305: 66.17,64.47 69.6,64.47 69.82,64.69 81.71,64.69 83.54,62.87 85.37,62.87 C7.1 | 66.17,64.47 63.65,66.98 63.42,66.98 63.2,66.75 | 63.2,66.75 63.2,67.89 62.28,68.81 62.05,68.81 U2.5 | 63.2,66.75 C6.+ | v36.45,18.75 38.05,18.75 38.28,18.97 39.19,18.97 39.42,18.75 39.65,18.75 v40.79,19.89 | 66.17,64.47 v65.94,64.24
  Bottom 0.305: 9.25,18.06 9.25,19.89 6.5,22.63 6.5,23.32 X4.1 | 9.25,18.06 9.25,4.12 7.87,2.74 6.73,2.74 X3.1 | 9.25,18.06 30.28,18.06 30.96,18.75 v36.45,18.75 | v40.79,19.89 44.22,19.89 63.65,39.32 63.65,52.58 63.88,52.81 63.88,53.03 63.65,53.26 63.65,55.09 63.88,55.32 63.88,55.55 63.65,55.78 63.65,61.95 v65.94,64.24
3.3V_F
  Top 0.305: 44.68,76.81 44.68,76.35 | 44.68,76.35 45.14,76.81 45.36,76.58 46.51,76.58 49.48,73.61 49.94,73.61 U1.3 | 44.68,76.35 U1.14 | C14.1 42.62,69.04 40.56,69.04 Q2.1 40.34,69.04 40.34,70.64 39.42,71.55 39.42,71.78 39.65,72.01 39.65,74.07 | 39.65,74.07 39.19,74.52 38.51,74.52 R11.2 | 44.68,76.81 44.22,76.81 43.99,76.58 42.16,76.58 39.65,74.07 | 44.68,76.81 U1.13
5V  (via drill 0.35)  (3 unrouted)
  Top 0.305: TP1.P$1 27.76,77.5 30.28,80.01 31.19,80.01 R6.1 31.19,79.78 31.19,77.5 R7.1 31.19,77.27 v31.19,66.52 31.19,65.38 23.88,58.06 23.88,50.06 | 23.88,50.06 8.79,50.06 8.1,49.38 6.73,49.38 X1.3 | 23.88,50.06 R13.2 | C2.2 89.71,59.21 89.71,61.04 C4.1 89.71,61.27 81.71,61.27 IC3.4 81.71,61.04 76,61.04 IC3.2 75.77,61.04 62.97,61.04 57.02,66.98 | 57.02,66.98 54.97,64.92 680UF.+ 54.97,64.69 48.34,58.06 48.34,54.18 48.56,53.95 48.56,53.72 48.34,53.49 48.34,51.44 48.11,51.21 48.34,50.98 48.34,48.46 47.42,47.55 47.42,46.63 R24.2 | 57.02,66.98 58.62,68.58 58.62,70.87 59.31,71.55 59.77,71.55 U2.3 59.99,71.55 59.99,71.09 59.77,70.87 59.77,70.64 60.45,69.95 61.37,69.95 62.05,70.64 62.05,70.87 61.82,71.09 61.82,71.55 U2.1 62.05,71.78 62.97,71.78 64.11,72.92 | 64.11,72.92 63.42,73.61 63.42,74.3 C3.+ | 64.11,72.92 64.8,72.24 65.94,72.24 R15.2 66.17,72.24 68,72.24 68.91,71.32 69.6,71.32 69.82,71.09 70.97,71.09 71.65,71.78 71.65,72.47 | 71.65,72.69 71.65,73.61 73.71,75.67 73.71,77.72 73.94,77.95 D3.A 73.94,78.18 73.94,78.64 75.08,79.78 76.45,79.78 R2.2 | R25.2 44.68,46.63 47.19,46.63 R24.2 | 54.51,36.58 54.74,36.35 56.11,36.35 57.02,35.43 57.02,32.23 57.48,31.77 IC1.1 | 54.51,36.58 50.85,40.23 50.85,44.12 48.56,46.41 47.42,46.41 R24.2 | 46.96,13.03 46.05,13.03 45.59,13.49 44.91,13.49 ICSP.2 | 46.96,13.03 50.39,13.03 R3.2 | 36.68,24.46 42.62,24.46 43.08,24 43.54,24 U4.18 43.76,24.23 44.22,24.23 45.14,23.32 | 36.68,24.46 36.22,24.46 35.99,24.69 35.08,24.69 U4.6 | 36.68,24.46 36.68,26.29 36.22,26.75 35.99,26.75 35.76,26.52 35.08,26.52 U4.4 | 46.96,13.03 46.96,21.49 45.14,23.32
  Top 0.305: 54.51,36.58 53.82,35.89 53.82,34.52 54.28,34.06 54.28,32.23 45.36,23.32 45.14,23.32
  Bottom 0.305: v31.19,66.52 52.91,66.52 54.51,64.92 54.97,64.92 680UF.+
+3V3  (via drill 0.35)
  Top 0.305: R19.2 44.68,58.75 43.31,58.75 43.08,58.98 42.85,58.75 42.39,58.75 R18.2 42.16,58.52 41.25,58.52 40.34,59.44 36.68,59.44 32.79,55.55 32.79,55.09 33.02,54.86 33.02,51.21 32.79,50.98 32.79,45.26 35.53,42.52 35.53,40.92 35.99,40.46 35.99,39.78 36.68,39.09 36.68,37.72 37.36,37.03 T2.2 37.36,36.58 37.59,36.35 37.59,36.12 v37.36,35.89 37.13,35.66 37.36,35.43 T2.5 | 29.13,34.52 27.53,34.52 R12.1 | 29.13,34.52 29.36,34.52 30.28,33.6 31.88,33.6 T1.5 32.11,33.38 32.33,33.38 32.56,33.6 32.79,33.6 v33.02,33.38 33.25,33.6 33.71,33.6 T1.2 | 29.13,34.52 28.22,33.6 28.22,32.69 R1.1
  Bottom 0.305: v37.36,35.89 35.53,35.89 v33.02,33.38
+5V  (via drill 0.35)
  Top 0.305: 35.08,66.52 35.08,68.81 R20.2 | 31.19,29.03 31.19,28.35 30.28,27.43 30.28,10.29 R23.2 | 32.56,36.58 31.65,36.58 R16.1 | 32.56,36.58 35.08,34.06 35.08,32.23 31.88,29.03 31.19,29.03 | 31.19,29.03 R17.1 | 35.08,66.52 34.16,66.52 32.33,64.69 32.33,63.55 v24.79,56.01 | v29.59,42.29 32.79,39.09 32.79,36.8 32.56,36.58 | 35.08,66.52 R21.2
  Bottom 0.305: v24.79,56.01 24.79,55.55 24.56,55.32 24.56,47.32 v29.59,42.29
A4/SDA  (via drill 0.35)
  Top 0.305: U4.27 40.56,30.4 40.56,31.09 40.79,31.32 40.79,33.6 44.45,37.26 44.45,44.81 R25.1 44.45,45.03 44.68,45.26 44.91,45.26 v45.59,44.58 | v19.99,49.38 10.39,49.38 7.87,46.86 6.73,46.86 X1.2
  Bottom 0.305: v19.99,49.38 19.99,53.03 27.99,61.04 43.08,61.04 48.56,55.55 48.56,55.32 48.34,55.09 48.34,54.18 48.56,53.95 48.56,53.72 48.34,53.49 48.34,51.44 48.11,51.21 48.34,50.98 48.34,46.18 46.74,44.58 v45.59,44.58
A5/SCL  (via drill 0.35)
  Top 0.305: 47.42,44.58 47.42,39.55 41.71,33.83 41.71,32.23 42.16,31.77 42.39,31.77 42.62,31.55 43.08,31.55 43.31,31.32 43.31,29.95 42.16,28.8 40.56,28.8 39.65,29.72 39.65,30.18 U4.28 | 47.42,44.58 47.42,44.81 R24.1 47.42,44.58 | v46.28,45.26 46.96,44.58 47.42,44.58
  Bottom 0.305: v46.28,45.26 45.82,45.72 45.82,50.98 45.59,51.21 45.82,51.44 45.82,53.49 45.59,53.72 45.59,53.95 45.82,54.18 45.82,55.09 46.05,55.32 46.05,55.55 41.02,60.58 28.22,60.58 24.1,56.46 24.1,46.41 22.05,44.35 9.25,44.35 9.02,44.58 8.56,44.12 6.73,44.12 X1.1
D0_RX1
  Top 0.305: 35.08,9.14 34.85,9.37 34.85,9.83 C11.2 | 35.08,9.14 35.53,8.69 35.53,6.17 T3.6 | 35.08,9.14 34.85,8.91 34.16,8.91 33.02,10.06 31.42,10.06 R23.1
D+
  Top 0.305: R10.1 15.65,70.18 14.96,70.18 14.73,70.41 12.45,70.41 12.22,70.18 12.22,69.04 C9.1 10.62,69.04 9.02,70.64 8.1,70.64 JP12.D+
D-
  Top 0.305: C13.1 14.5,74.07 13.82,74.07 12.9,73.15 12.9,72.01 R5.1 12.67,71.78 9.47,71.78 9.02,71.32 8.1,71.32 JP12.D-
DTR
  Top 0.305: 25.25,48.92 25.25,54.63 27.99,57.38 29.13,57.38 38.73,66.98 39.65,66.98 Q2.3 | 25.25,48.92 24.33,48.01 24.1,48.01 23.88,48.23 R13.1 | 25.25,48.92 25.93,48.23 27.76,48.23 C8.1
FTDI_DTR
  Top 0.305: Q2.2 39.19,69.04 39.19,71.09 38.28,72.01 38.28,72.69 R11.1 38.28,72.92 37.36,72.92 36.91,73.38 36.91,75.44 37.59,76.12 39.65,76.12 42.62,79.1 51.08,79.1 51.54,78.64 51.54,72.69 51.08,72.24 50.16,72.24 U1.1
GND  (via drill 0.35)  (7 unrouted)
  other vias: 37.72,62.59 6.25,79.32
  pour Top: -0.05,82.04 -0.05,0 92.02,0 92.02,82.04 0.41,82.04
  pour Bottom: -0.05,82.04 -0.05,0 92.02,0 92.02,82.04 0.56,82.04
GPIO2  (via drill 0.35)
  Top 0.305: v34.39,30.4 36.45,30.4 U4.32 | v29.59,37.72 29.59,38.86 MOSFET_60V_12A.1
  Bottom 0.305: v34.39,30.4 30.96,30.4 29.59,31.77 v29.59,37.72
GPIO3  (via drill 0.35)
  Top 0.305: v31.42,27.43 32.79,28.8 35.08,28.8 U4.1
  Bottom 0.305: v31.42,27.43 8.33,27.43 7.42,28.35 6.73,28.35 X4.3
GPIO4  (via drill 0.35)
  Top 0.305: v30.96,25.15 30.96,25.38 33.93,28.35 34.16,28.35 34.39,28.12 35.08,28.12 U4.2 | v29.59,25.15 28.68,25.15 12.45,8.91 8.56,8.91 7.42,7.77 6.73,7.77 X3.3
  Bottom 0.305: v29.59,25.15 v30.96,25.15
GPIO5  (via drill 0.35)
  Top 0.305: v35.08,22.17 35.31,21.95 36.45,21.95 U4.9 | v8.56,21.72 8.56,20.57 6.5,18.52 6.5,17.83 X3.7
  Bottom 0.305: v35.08,22.17 30.51,26.75 13.59,26.75 v8.56,21.72
IO4  (via drill 0.35)
  Top 0.305: v37.13,3.2 36.45,3.89 36.45,4.12 T3.2 | R22.2 41.48,48.92 41.48,50.52 42.16,51.21 42.16,51.89 X5.7
  Bottom 0.305: v37.13,3.2 37.13,34.52 38.51,35.89 38.51,37.26 41.71,40.46 41.71,50.75 42.16,51.21 42.16,51.89 X5.7
MISO  (via drill 0.35)
  Top 0.305: ICSP.1 44.91,16 46.05,17.14 45.14,18.06 TP4.P$1 44.91,18.29 43.99,19.2 43.99,20.57 42.85,21.72 42.39,21.72 U4.16 | v38.73,18.29 37.13,18.29 36.91,18.06 32.33,18.06 v30.96,19.43 | v15.87,18.75 7.42,10.29 6.73,10.29 X3.4
  Bottom 0.305: X3.4 6.5,10.29 5.36,10.29 3.99,11.66 3.99,29.03 5.82,30.86 6.5,30.86 X4.4 | v38.73,18.29 43.08,18.29 44.68,16.69 44.68,16.23 ICSP.1 | v30.96,19.43 27.76,19.43 27.08,18.75 v15.87,18.75
MOSI  (via drill 0.35)
  Top 0.305: TP2.P$1 42.39,10.06 43.31,10.97 43.31,12.57 42.39,13.49 ICSP.4 42.16,13.49 41.25,14.4 41.25,14.86 40.79,15.32 40.79,15.54 41.25,16 41.25,16.46 40.79,16.92 40.79,17.6 | 40.79,17.6 40.79,18.75 41.48,19.43 41.48,21.72 U4.15 | X4.5 6.5,33.38 5.82,33.38 3.99,31.55 3.99,14.17 5.36,12.8 6.5,12.8 X3.5 6.73,12.8 7.42,12.8 v9.93,15.32 | v30.96,17.6 40.79,17.6
  Bottom 0.305: v30.96,17.6 12.22,17.6 v9.93,15.32
N$1
  Top 0.305: 57.48,30.18 55.88,30.18 55.42,30.63 55.42,32 56.57,33.15 56.57,34.98 56.34,35.2 55.19,35.2 L1.2 | 57.48,30.18 59.08,30.18 59.54,30.63 59.54,34.52 53.82,40.23 53.82,40.92 1N5824.C | 57.48,30.18 IC1.2
N$2
  Top 0.305: R2.1 76.45,77.95 76.45,75.89 LED2.A
N$3  (via drill 0.35)
  Top 0.305: v30.96,24 35.08,24 U4.7
  Bottom 0.305: v30.96,24 28.22,24 27.08,25.15 26.62,25.15 16MHZ.2
N$4  (via drill 0.35)
  Top 0.305: v31.65,23.32 35.08,23.32 U4.8
  Bottom 0.305: v31.65,23.32 30.05,23.32 27.08,20.34 16MHZ.1
N$5  (via drill 0.35)
  Top 0.305: v21.59,45.03 22.96,43.66 22.96,41.38 MOSFET_60V_12A.3
  Bottom 0.305: X2.2 7.87,60.35 21.59,46.63 v21.59,45.03
N$6  (via drill 0.35)
  Top 0.305: v30.51,71.78 14.73,71.78 R5.2 | v43.54,77.72 43.76,77.72 43.99,77.5 44.68,77.5 U1.12
  Bottom 0.305: v30.51,71.78 33.02,71.78 38.96,77.72 v43.54,77.72
N$7  (via drill 0.35)
  Top 0.305: v30.51,70.18 17.7,70.18 R10.2 | v39.88,75.44 42.85,78.41 43.99,78.41 44.22,78.18 44.68,78.18 U1.11
  Bottom 0.305: v30.51,70.18 33.02,70.18 38.28,75.44 v39.88,75.44
N$8
  Top 0.305: R6.2 33.02,80.01 34.85,80.01 LED3.A
N$9  (via drill 0.35)
  other vias: 14,6.1
N$10
  Top 0.305: LED4.A 33.02,77.5 R7.2
N$11  (via drill 0.35)
  other vias: 38.56,6.1
N$14  (via drill 0.35)
  other vias: 65.25,6.1
N$15  (via drill 0.35)
  Top 0.305: 71.88,69.04 72.11,69.04 73.71,70.64 74.63,70.64 R14.2 | 71.88,69.04 68.45,69.04 67.08,70.41 66.17,70.41 R15.1 | v74.4,63.78 74.85,63.32 IC3.1 | 71.88,69.04 v71.88,67.44
  Bottom 0.305: v74.4,63.78 71.88,66.29 v71.88,67.44
N$16  (via drill 0.35)
  other vias: 83.67,6.1
N$17
  Top 0.305: JP12.MTN4 7.87,66.06 2.39,66.06 JP12.MTN3 2.39,66.29 2.39,74.98 JP12.MTN1 2.39,75.21 7.87,75.21 JP12.MTN2 8.1,74.98 10.62,74.98 C1.1
N$18  (via drill 0.35)
  other vias: 14.2,19.89
N$19  (via drill 0.35)
  other vias: 38.76,19.89
N$20  (via drill 0.35)
  other vias: 65.46,19.89
N$21  (via drill 0.35)
  other vias: 83.87,19.89
N$22  (via drill 0.35)
  other vias: 15.27,36.47
N$23  (via drill 0.35)
  other vias: 39.83,36.47
N$24  (via drill 0.35)
  other vias: 66.52,36.47
N$25  (via drill 0.35)
  other vias: 84.94,36.47
N$26  (via drill 0.35)
  other vias: 15.39,58.09
N$27  (via drill 0.35)
  other vias: 39.95,58.09
N$28  (via drill 0.35)
  other vias: 66.65,58.09
N$29  (via drill 0.35)
  other vias: 85.06,58.09
N$30  (via drill 0.35)
  other vias: 15.49,66.32
N$31  (via drill 0.35)
  other vias: 42.09,70.41
N$32  (via drill 0.35)
  other vias: 68.78,70.41
N$33  (via drill 0.35)
  other vias: 87.2,70.41
N$34  (via drill 0.35)
  other vias: 14.33,77.27
N$35  (via drill 0.35)
  other vias: 40.92,80.24
N$36  (via drill 0.35)
  other vias: 67.61,80.24
N$37  (via drill 0.35)
  other vias: 86.03,80.24
N$38  (via drill 0.35)
  other vias: 51.21,2.67
N$39  (via drill 0.35)
  other vias: 41.83,2.72
N$40  (via drill 0.35)
  other vias: 41.1,63.53
N$42  (via drill 0.35)
  other vias: 43.28,64.41
N$43  (via drill 0.35)
  other vias: 75.77,44.22
N$44  (via drill 0.35)
  other vias: 56.95,46.86
N$45  (via drill 0.35)
  other vias: 78.97,30.25
N$46  (via drill 0.35)
  other vias: 87.12,45.36
N$47  (via drill 0.35)
  other vias: 75.84,17.91
N$48  (via drill 0.35)
  other vias: 72.59,9.02
N$49  (via drill 0.35)
  other vias: 87.43,13.72
N$50  (via drill 0.35)
  other vias: 51.31,21.74
N$51  (via drill 0.35)
  other vias: 46.86,29.44
N$52  (via drill 0.35)
  other vias: 22.38,33.88
N$53  (via drill 0.35)
  other vias: 19,23.24
N$54  (via drill 0.35)
  other vias: 21.31,11.23
N$55  (via drill 0.35)
  other vias: 33.35,14.4
N$56  (via drill 0.35)
  other vias: 21.51,62.15
N$57  (via drill 0.35)
  other vias: 25.88,67.36
N$58  (via drill 0.35)
  other vias: 21.44,78.05
N$60  (via drill 0.35)
  other vias: 67.89,47.12
N$61  (via drill 0.35)
  other vias: 59.56,58.95
N$62  (via drill 0.35)
  other vias: 37.67,45.87
PI_5V  (via drill 0.35)
  Top 0.305: L1.1 55.19,32.46 54.97,32.23 54.97,31.55 | 54.97,31.55 54.97,27.66 55.65,26.98 | 55.65,26.98 55.88,26.75 57.48,26.75 IC1.4 | 55.65,26.98 55.42,26.75 55.42,24.23 59.31,20.34 59.31,17.6 220UF.+ | 54.97,31.55 v54.74,31.55
  Bottom 0.305: v54.74,31.55 43.31,42.98 43.31,50.98 43.08,51.21 43.08,51.44 43.31,51.66 43.31,53.49 43.08,53.72 43.08,53.95 43.31,54.18 43.31,55.09 43.54,55.32 43.54,55.55 42.62,56.46 35.99,56.46 34.85,55.32 34.85,55.09 34.39,54.63 X5.2
PI_RX
  Top 0.305: T2.4 36.45,34.98 36.45,34.29 36.91,33.83 38.73,33.83 40.34,35.43 40.56,35.43 42.85,37.72 42.85,50.52 43.31,50.98 43.31,52.58 43.54,52.81 43.54,53.03 43.31,53.26 43.31,53.49 44.45,54.63 X5.10 44.68,54.63 44.68,55.09 45.59,56.01 44.91,56.69 44.91,57.38 R19.1
PI_SCL  (via drill 0.35)
  Top 0.305: T1.4 31.88,34.29 30.28,34.29 28.91,35.66 27.53,35.66 R12.2 27.3,35.89 27.3,38.18 27.08,38.41 27.08,45.03 v28.91,46.86
  Bottom 0.305: v28.91,46.86 34.39,46.86 39.42,51.89 X5.5
PI_SDA  (via drill 0.35)
  Top 0.305: v33.25,32 33.71,32.46 T1.1 | v30.28,32.23 30.05,32.46 29.59,32.46 R1.2
  Bottom 0.305: v33.25,32 30.51,32 v30.28,32.23 30.28,43.66 25.02,48.92 25.02,55.09 29.36,59.44 29.36,59.89 29.59,60.12 30.51,60.12 32.79,57.84 32.79,55.09 33.02,54.86 33.02,54.18 33.93,53.26 35.53,53.26 36.91,51.89 X5.3
PI_TX
  Top 0.305: T2.1 38.28,37.03 38.73,37.03 41.71,40.01 41.71,45.49 40.11,47.09 40.11,50.29 40.79,50.98 40.79,52.58 41.02,52.81 41.02,53.03 40.79,53.26 41.94,54.41 X5.8 42.16,54.63 42.16,57.61 R18.1
RESET  (via drill 0.35)
  Top 0.305: 49.02,6.4 49.02,6.63 50.39,8 50.39,10.97 R3.1 | 49.02,6.4 S1.3 49.25,6.4 | 49.02,6.4 S1.4 42.16,6.4 35.76,12.8 | 35.76,12.8 38.96,16 39.65,16 ICSP.5 | 35.76,12.8 35.08,12.12 35.08,11.2 C11.1 | 38.96,32.46 38.51,32.46 38.28,32.23 37.59,32.23 33.71,36.12 33.71,42.98 29.59,47.09 29.59,48.23 C8.2 | 38.96,32.46 38.96,30.4 U4.29 38.96,30.18 38.96,29.72 v38.28,29.03 | 38.96,32.46 TP6.P$1
  Bottom 0.305: v38.28,29.03 37.59,28.35 37.59,18.29 39.65,16.23 ICSP.5
RX  (via drill 0.35)
  Top 0.305: v38.96,35.2 38.28,35.2 T2.6 | v38.28,31.55 38.28,30.4 U4.30 | 45.14,67.21 40.79,67.21 40.11,67.89 39.19,67.89 38.96,67.67 38.51,67.67 37.13,69.04 36.45,69.04 R20.1 | 45.14,67.21 46.05,68.12 46.05,69.72 44.68,71.09 43.08,71.09 42.62,71.55 41.94,71.55 41.02,72.47 R8.1 | v43.54,41.6 43.54,43.66 43.31,43.89 43.31,48.46 45.82,50.98 45.82,52.58 45.59,52.81 45.59,53.03 45.82,53.26 45.82,55.09 46.05,55.32 46.05,66.29 45.14,67.21
  Bottom 0.305: v38.28,31.55 38.96,32.23 v38.96,35.2 40.34,35.2 43.54,38.41 v43.54,41.6
RXD  (via drill 0.35)
  Top 0.305: v34.62,61.72 34.16,61.72 29.36,56.92 28.22,56.92 25.7,54.41 25.7,51.44 27.53,49.61 30.51,49.61 30.96,49.15 30.96,46.41 35.08,42.29 35.08,39.78 R9.2 | v48.79,75.44 48.56,75.21 49.48,74.3 49.94,74.3 U1.4
  Bottom 0.305: v34.62,61.72 34.62,62.87 31.65,65.84 30.73,65.84 30.51,66.06 30.51,66.98 37.59,74.07 47.42,74.07 v48.79,75.44
RXLED  (via drill 0.35)
  Top 0.305: v41.71,74.75 42.62,73.84 43.54,73.84 43.99,74.3 44.68,74.3 U1.17 | v39.42,77.04 38.73,77.72 38.51,77.72 38.28,77.5 LED4.C
  Bottom 0.305: v39.42,77.04 v41.71,74.75
SCK  (via drill 0.35)
  Top 0.305: TP5.P$1 41.25,17.14 42.16,16.23 ICSP.3 42.39,16 43.99,14.4 44.22,14.4 44.45,14.63 45.59,14.63 46.51,15.54 46.51,18.75 43.76,21.49 43.76,23.09 U4.17 | 9.25,17.14 9.25,34.52 7.65,36.12 X4.6 | 9.25,17.14 9.25,16.69 7.87,15.32 6.73,15.32 X3.6 | 9.25,17.14 v11.07,15.32
  Bottom 0.305: v11.07,15.32 24.1,15.32 32.79,6.63 32.79,6.4 36.68,2.52 37.59,2.52 39.88,4.8 39.88,11.2 41.48,12.8 41.25,13.03 41.25,15.09 42.16,16 ICSP.3
SCL
  Top 0.305: T1.3 33.71,34.29 32.79,35.2 31.19,35.2 30.51,35.89 30.51,36.58 R16.2
SDA  (via drill 0.35)
  Top 0.305: 30.05,30.63 31.88,32.46 T1.6 | 30.05,30.63 v30.05,30.18 30.05,29.26 R17.2 | v36.45,23.77 39.19,23.77 40.56,22.4 40.56,21.95 U4.14 | 30.05,30.63 15.87,30.63 7.87,38.63 6.73,38.63 X4.7
  Bottom 0.305: v30.05,30.18 v36.45,23.77
TX  (via drill 0.35)
  Top 0.305: T2.3 36.45,36.8 v35.76,36.8 35.08,37.49 35.08,37.95 R9.1 | v30.05,59.44 35.08,64.47 35.08,65.15 R21.1 | v35.76,32.69 37.36,31.09 37.36,30.4 U4.31
  Bottom 0.305: v30.05,59.44 25.48,54.86 25.48,49.15 35.76,38.86 35.76,37.26 | v35.76,36.8 35.76,37.26 | v35.76,32.69 32.56,32.69 32.33,32.92 32.33,33.83 35.76,37.26
TXD
  Top 0.305: R8.2 42.85,72.47 43.31,72.47 43.54,72.24 43.99,72.24 44.22,72.47 44.68,72.47 U1.20
TXLED  (via drill 0.35)
  Top 0.305: v46.05,78.41 49.25,78.41 49.48,78.18 49.94,78.18 U1.10 | v39.42,79.55 38.73,80.24 38.51,80.24 38.28,80.01 LED3.C
  Bottom 0.305: v46.05,78.41 40.56,78.41 v39.42,79.55
USBVCC  (via drill 0.35)
  Top 0.305: C15.+ 48.79,33.15 51.08,33.15 C12.1 51.08,33.38 v51.08,38.86 | 50.85,71.32 49.25,71.32 48.56,72.01 48.56,73.38 45.82,76.12 45.36,75.67 44.91,75.67 U1.15 | 50.85,71.32 52.45,72.92 52.45,73.84 53.37,74.75 54.05,74.75 F1.2 54.28,74.75 54.28,75.44 56.79,77.95 62.05,77.95 D1.A | v51.77,65.84 51.77,70.41 50.85,71.32
  Bottom 0.305: v51.08,38.86 51.08,40.23 50.85,40.46 50.85,52.58 50.62,52.81 50.62,53.03 50.85,53.26 50.85,55.09 50.62,55.32 50.62,55.55 51.77,56.69 v51.77,65.84
VIN  (via drill 0.35)
  Top 0.305: v75.77,59.89 75.77,58.98 IC3.3 | C5.+ 72.8,66.29 74.17,66.29 v74.85,65.61 78.28,69.04 83.08,69.04 85.14,66.98 87.88,66.98 J3.VIN0 | v34.39,67.44 v31.65,64.69
  Bottom 0.305: v75.77,59.89 75.77,64.69 v74.85,65.61 72.34,68.12 71.42,68.12 70.74,67.44 v34.39,67.44 | v31.65,64.69 7.87,64.69 3.99,60.81 3.99,59.21 5.36,57.84 6.5,57.84 X2.1
VUSB  (via drill 0.35)
  Top 0.305: 54.28,71.78 57.02,71.78 C10.1 | v9.02,73.15 8.1,72.24 JP12.VBUS | v53.59,73.15 54.28,72.47 54.28,71.78 | 54.28,71.78 F1.1
  Bottom 0.305: v9.02,73.15 31.88,73.15 38.96,80.24 39.88,80.24 40.11,80.01 40.11,79.55 40.79,78.87 45.36,78.87 45.59,79.1 47.65,79.1 v53.59,73.15